# EAGLE design Cpu_pwm_mega1284 (EAGLE 7.6.0)
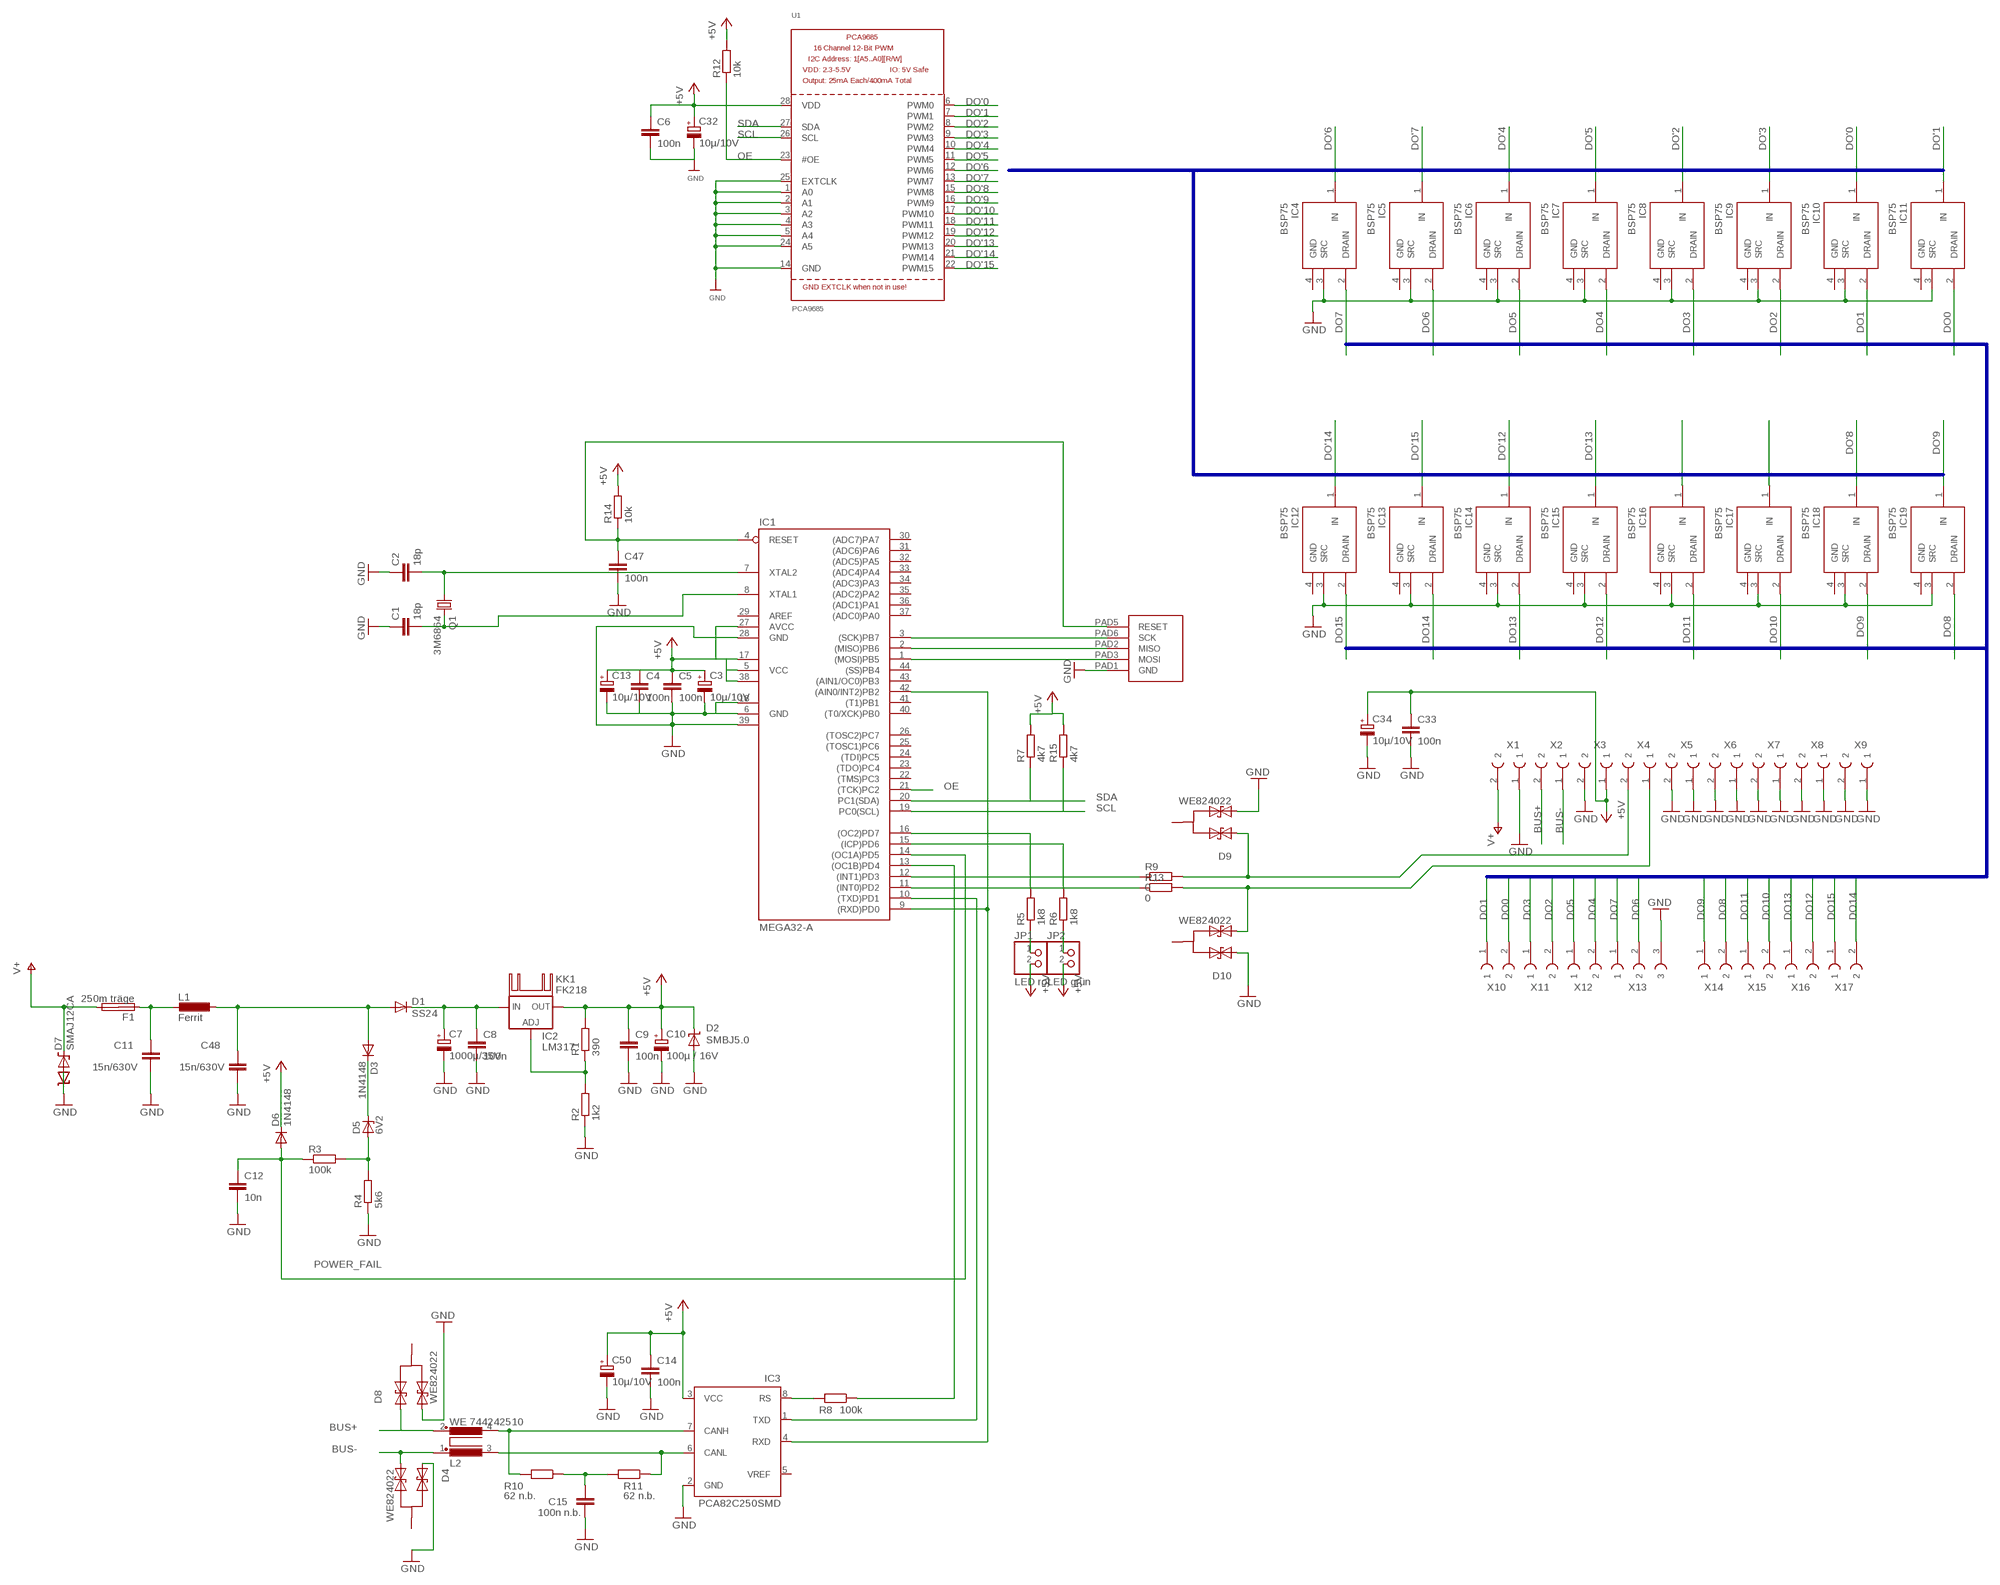
[diagram p0: schematic, sheet 1]

## Parts
C1  18p  C-EUC0603K  [C0603K]
C2  18p  C-EUC0603K  [C0603K]
C3  10µ/10V  CPOL-EUA/3216-18W  [A/3216-18W]
C4  100n  C-EUC0603K  [C0603K]
C5  100n  C-EUC0603K  [C0603K]
C6  100n  C-EUC0603K  [C0603K]
C7  1000µ/35V  CPOL-EUE5-13  [E5-13]
C8  100n  C-EUC0603K  [C0603K]
C9  100n  C-EUC0603K  [C0603K]
C10  100µ / 16V  CPOL-EUSMCD  [SMC_D]
C11  15n/630V  C-EUC1210K  [C1210K]
C12  10n  C-EUC0603K  [C0603K]
C13  10µ/10V  CPOL-EUA/3216-18W  [A/3216-18W]
C14  100n  C-EUC0603K  [C0603K]
C15  100n n.b.  C-EUC0603K  [C0603K]
C32  10µ/10V  CPOL-EUA/3216-18W  [A/3216-18W]
C33  100n  C-EUC0603K  [C0603K]
C34  10µ/10V  CPOL-EUA/3216-18W  [A/3216-18W]
C47  100n  C-EUC0603K  [C0603K]
C48  15n/630V  C-EUC1210K  [C1210K]
C50  10µ/10V  CPOL-EUA/3216-18W  [A/3216-18W]
D1  SS24  DIODE-SMB  [SMB]
D2  SMBJ5.0  SUPPRESSOR-SMBJ  [SMBJ]
D3  1N4148  DIODE-MINIMELF  [MINIMELF]
D4  WE824022  NUP2105L  [SOT23]
D5  6V2  ZENER-DIODESOD80C  [SOD80C]
D6  1N4148  DIODE-MINIMELF  [MINIMELF]
D7  SMAJ12CA  DIODE-DO-214AC  [DO-214AC]
D8  WE824022  NUP2105L  [SOT23]
D9  WE824022  NUP2105L  [SOT23]
D10  WE824022  NUP2105L  [SOT23]
F1  250m träge  SHK20L  [SHK20L]
IC1  MEGA32-A  [TQFP44]
IC2  LM317  LM317TS  [317TS]
IC3  PCA82C250SMD  [SO8]
IC4  BSP75  [SOT223]
IC5  BSP75  [SOT223]
IC6  BSP75  [SOT223]
IC7  BSP75  [SOT223]
IC8  BSP75  [SOT223]
IC9  BSP75  [SOT223]
IC10  BSP75  [SOT223]
IC11  BSP75  [SOT223]
IC12  BSP75  [SOT223]
IC13  BSP75  [SOT223]
IC14  BSP75  [SOT223]
IC15  BSP75  [SOT223]
IC16  BSP75  [SOT223]
IC17  BSP75  [SOT223]
IC18  BSP75  [SOT223]
IC19  BSP75  [SOT223]
JP1  LED rot  PINHD-1X2  [1X02]
JP2  LED grün  PINHD-1X2  [1X02]
KK1  FK218  [FK218]
L1  Ferrit  L-EUL1806  [L1806]
L2  WE 744242510  744242510  [744242510]
Q1  3M6864  CRYSTALHC49UP  [HC49UP]
R1  390  R-EU_R0603  [R0603]
R2  1k2  R-EU_R0603  [R0603]
R3  100k  R-EU_R0603  [R0603]
R4  5k6  R-EU_R0603  [R0603]
R5  1k8  R-EU_R0603  [R0603]
R6  1k8  R-EU_R0603  [R0603]
R7  4k7  R-EU_R0603  [R0603]
R8  100k  R-EU_R0603  [R0603]
R9  0  R-EU_R0603  [R0603]
R10  62 n.b.  R-EU_R1210  [R1210]
R11  62 n.b.  R-EU_R1210  [R1210]
R12  10k  R-EU_R0603  [R0603]
R13  0  R-EU_R0603  [R0603]
R14  10k  R-EU_R0603  [R0603]
R15  4k7  R-EU_R0603  [R0603]
U1  PCA9685  [TSSOP28]
U$1  ATMEL_ISP  [ATMEL_ISP]
X1  AR-KLEMME_508_2POLPTR  [W237-2E]
X2  AR-KLEMME_508_2POLPTR  [W237-2E]
X3  AR-KLEMME_508_2POLPTR  [W237-2E]
X4  AR-KLEMME_508_2POLPTR  [W237-2E]
X5  AR-KLEMME_508_2POLPTR  [W237-2E]
X6  AR-KLEMME_508_2POLPTR  [W237-2E]
X7  AR-KLEMME_508_2POLPTR  [W237-2E]
X8  AR-KLEMME_508_2POLPTR  [W237-2E]
X9  AR-KLEMME_508_2POLPTR  [W237-2E]
X10  AR-KLEMME_508_2POLPTR  [W237-2E]
X11  AR-KLEMME_508_2POLPTR  [W237-2E]
X12  AR-KLEMME_508_2POLPTR  [W237-2E]
X13  AR-KLEMME_508_3POLPTR  [W237-3E]
X14  AR-KLEMME_508_2POLPTR  [W237-2E]
X15  AR-KLEMME_508_2POLPTR  [W237-2E]
X16  AR-KLEMME_508_2POLPTR  [W237-2E]
X17  AR-KLEMME_508_2POLPTR  [W237-2E]

## Nets
+5V: C3.+ C4.1 C5.1 C6.1 C9.1 C10.+ C13.+ C14.1 C32.+ C33.1 C34.+ C50.+ D2.C D6.C IC1.5(VCC) IC1.17(VCC1) IC1.27(AVCC) IC1.38(VCC2) IC2.2(OUT) IC3.3(VCC) JP1.2 JP2.2 R1.2 R7.2 R12.2 R14.2 R15.2 U1.28(VDD) X3.1
/RESET: C47.1 IC1.4(RESET) R14.1 U$1.PAD5(RESET)
BUS+: D8.1 L2.2 X2.2
BUS-: D4.2 L2.1 X2.1
DO0: IC11.2(DRAIN) X10.2
DO1: IC10.2(DRAIN) X10.1
DO2: IC9.2(DRAIN) X11.2
DO3: IC8.2(DRAIN) X11.1
DO4: IC7.2(DRAIN) X12.2
DO5: IC6.2(DRAIN) X12.1
DO6: IC5.2(DRAIN) X13.2
DO7: IC4.2(DRAIN) X13.1
DO8: IC19.2(DRAIN) X14.2
DO9: IC18.2(DRAIN) X14.1
DO10: IC17.2(DRAIN) X15.2
DO11: IC16.2(DRAIN) X15.1
DO12: IC15.2(DRAIN) X16.2
DO13: IC14.2(DRAIN) X16.1
DO14: IC13.2(DRAIN) X17.2
DO15: IC12.2(DRAIN) X17.1
DO'0: IC10.1(IN) U1.6(PWM0)
DO'1: IC11.1(IN) U1.7(PWM1)
DO'2: IC8.1(IN) U1.8(PWM2)
DO'3: IC9.1(IN) U1.9(PWM3)
DO'4: IC6.1(IN) U1.10(PWM4)
DO'5: IC7.1(IN) U1.11(PWM5)
DO'6: IC4.1(IN) U1.12(PWM6)
DO'7: IC5.1(IN) U1.13(PWM7)
DO'8: IC18.1(IN) U1.15(PWM8)
DO'9: IC19.1(IN) U1.16(PWM9)
DO'10: IC16.1(IN) U1.17(PWM10)
DO'11: IC17.1(IN) U1.18(PWM11)
DO'12: IC14.1(IN) U1.19(PWM12)
DO'13: IC15.1(IN) U1.20(PWM13)
DO'14: IC12.1(IN) U1.21(PWM14)
DO'15: IC13.1(IN) U1.22(PWM15)
GND: C1.1 C2.1 C3.- C4.2 C5.2 C6.2 C7.- C8.2 C9.2 C10.- C11.2 C12.2 C13.- C14.2 C15.1 C32.- C33.2 C34.- C47.2 C48.2 C50.- D2.A D4.1 D7.A D8.2 D9.2 D10.1 IC1.6(GND) IC1.18(GND1) IC1.28(GND) IC1.39(GND2) IC3.2(GND) IC4.3(SRC) IC5.3(SRC) IC6.3(SRC) IC7.3(SRC) IC8.3(SRC) IC9.3(SRC) IC10.3(SRC) IC11.3(SRC) IC12.3(SRC) IC13.3(SRC) IC14.3(SRC) IC15.3(SRC) IC16.3(SRC) IC17.3(SRC) IC18.3(SRC) IC19.3(SRC) R2.1 R4.1 U1.1(A0) U1.2(A1) U1.3(A2) U1.4(A3) U1.5(A4) U1.14(GND) U1.24(A5) U1.25(EXTCLK) U$1.PAD1(GND) X1.1 X3.2 X5.1 X5.2 X6.1 X6.2 X7.1 X7.2 X8.1 X8.2 X9.1 X9.2 X13.3
MISO: IC1.2((MISO)PB6) U$1.PAD2(MISO)
MOSI: IC1.1((MOSI)PB5) U$1.PAD3(MOSI)
N$1: C11.1 F1.1A L1.2
N$2: D3.C D5.C
N$3: D5.A R3.2 R4.2
N$4: C1.2 IC1.8(XTAL1) Q1.2
N$6: C2.2 IC1.7(XTAL2) Q1.1
N$7: IC3.8(RS) R8.2
N$8: IC1.13((OC1B)PD4) R8.1
N$9: IC2.1(ADJ) R1.1 R2.2
N$11: IC3.6(CANL) L2.3 R11.1
N$12: IC3.7(CANH) L2.4 R10.2
N$15: C48.1 D1.A D3.A L1.1
N$16: C7.+ C8.1 D1.C IC2.3(IN)
N$18: IC1.11((INT0)PD2) R13.1
N$19: IC1.12((INT1)PD3) R9.1
N$25: C15.2 R10.1 R11.2
N$113: JP1.1 R5.1
N$114: JP2.1 R6.1
N$115: IC1.16((OC2)PD7) R5.2
N$116: IC1.15((ICP)PD6) R6.2
OE: IC1.21((TCK)PC2) R12.1 U1.23(#OE)
POWER_FAIL: C12.1 D6.A IC1.14((OC1A)PD5) R3.1
RXD: IC1.9((RXD)PD0) IC1.42((AIN0/INT2)PB2) IC3.4(RXD)
RXD1: D10.2 R13.2 X4.1
SCK: IC1.3((SCK)PB7) U$1.PAD6(SCK)
SCL: IC1.19(PC0(SCL)) R15.1 U1.26(SCL)
SDA: IC1.20(PC1(SDA)) R7.1 U1.27(SDA)
TSD1: D9.1 R9.2 X4.2
TXD: IC1.10((TXD)PD1) IC3.1(TXD)
V+: D7.C F1.2A X1.2
Unconnected: D4.3 D8.3 D9.3 D10.3 F1.1B F1.2B IC1.22((TMS)PC3) IC1.23((TDO)PC4) IC1.24((TDI)PC5) IC1.25((TOSC1)PC6) IC1.26((TOSC2)PC7) IC1.29(AREF) IC1.30((ADC7)PA7) IC1.31((ADC6)PA6) IC1.32((ADC5)PA5) IC1.33((ADC4)PA4) IC1.34((ADC3)PA3) IC1.35((ADC2)PA2) IC1.36((ADC1)PA1) IC1.37((ADC0)PA0) IC1.40((T0/XCK)PB0) IC1.41((T1)PB1) IC1.43((AIN1/OC0)PB3) IC1.44((SS)PB4) IC3.5(VREF) IC4.4(GND) IC5.4(GND) IC6.4(GND) IC7.4(GND) IC8.4(GND) IC9.4(GND) IC10.4(GND) IC11.4(GND) IC12.4(GND) IC13.4(GND) IC14.4(GND) IC15.4(GND) IC16.4(GND) IC17.4(GND) IC18.4(GND) IC19.4(GND)

## Buses
DO[0..30]
DO'[0..7]
DO'[8..15]

## Library data of the parts
C1 C2 C4-C6 C8 C9 C11 C12 C14 C15 C33 C47 C48 = rcl:C-EU: CAPACITOR, European symbol
C3 C7 C10 C13 C32 C34 C50 = rcl:CPOL-EU: POLARIZED CAPACITOR, European symbol
D1 D3 D6 D7 = diode:DIODE-: DIODE
D2 = diode:SUPPRESSOR-: Suppressor diode
D4 D8-D10 = mylib:NUP2105L
D5 = diode:ZENER-DIODE: Z-Diode
F1 = fuse:SHK20L: FUSE HOLDER 5 x 20 mm, SH contact, SHH1 Schukat, E1073 Buerklin
IC1 = atmel:MEGA32: MICROCONTROLLER 32 Kbytes FLASH 2 Kbytes SRAM 1 Kbytes EEPROM USART 8-channel 10 bit ADC Source: www.atmel.com .. doc2503.pdf; MPN: ATMEGA32-16AU; OC_FARNELL: 9171274; OC_NEWARK: 69K6677
IC2 = v-reg:LM317TS: VOLTAGE REGULATOR
IC3 = mylib:PCA82C250: CAN CONTROLLER INTERFACE
IC4-IC19 = mylib:BSP75
JP1 JP2 = pinhead:PINHD-1X2: PIN HEADER
KK1 = heatsink:FK218: HEATSINK manufacturer Fischer/distributor Buerklin
L1 = mylib:L-EU: INDUCTOR, European symbol
L2 = mylib:744242510
Q1 = crystal:CRYSTAL: CRYSTAL; OC_FARNELL: unknown; OC_NEWARK: unknown
R1-R15 = rcl:R-EU_: RESISTOR, European symbol
U1 = microbuilder:PCA9685: PCA9685 - 16 Channel 12-Bit I2C PWM Controller 5.0V tolerant 16 channel, 12-bit I2C PWM controller with 25mA per output (max. 400mA total) Digikey: 568-5931-1-ND
U$1 = mylib:ATMEL_ISP
X1-X12 X14-X17 = mylib:AR-KLEMME_508_2POL
X13 = mylib:AR-KLEMME_508_3POL

## Board
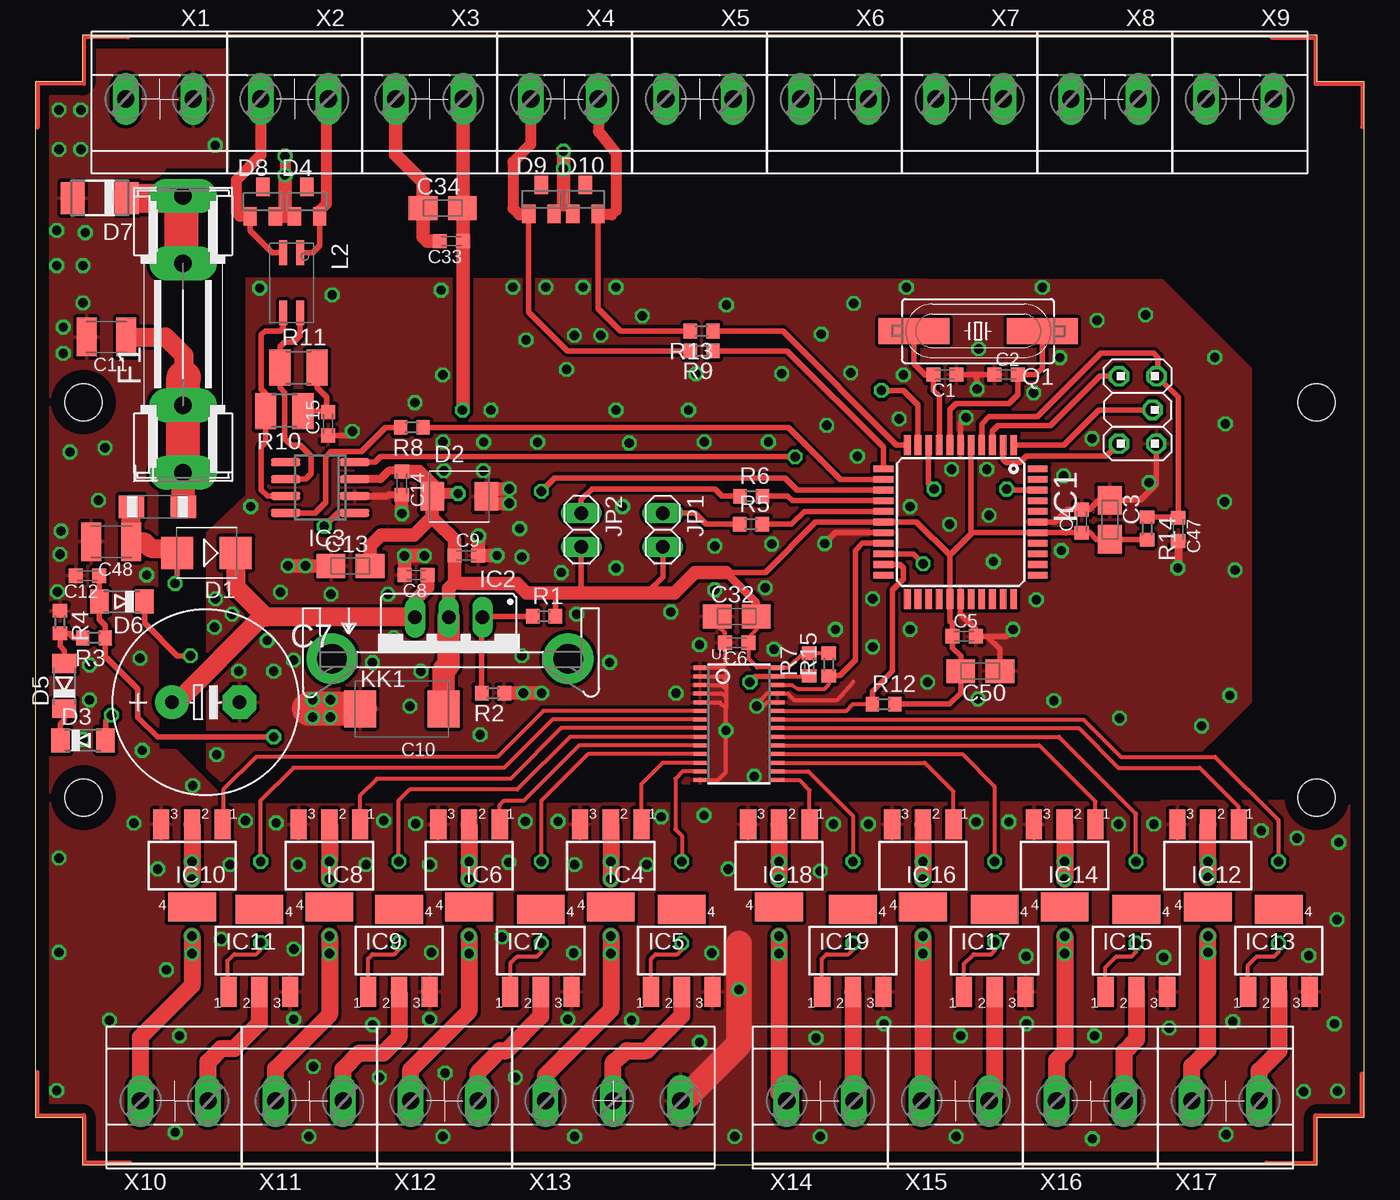
[diagram p1: board, top side]
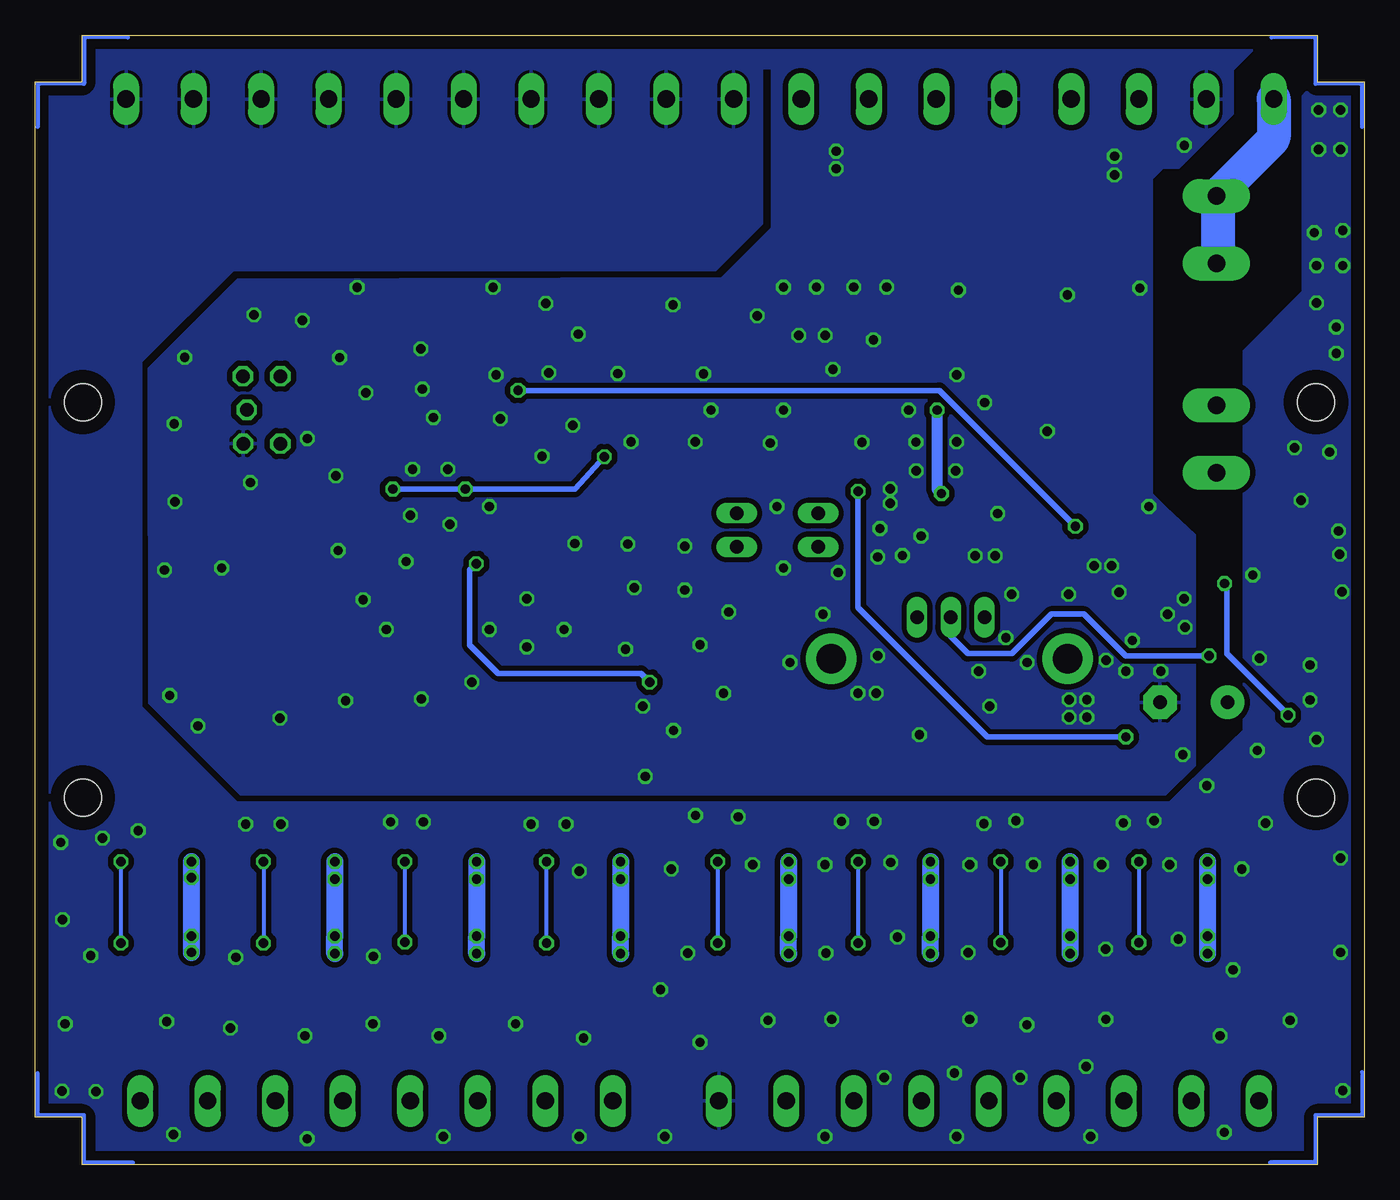
[diagram p2: board, bottom side, seen from below]

Size 100 x 84.99 mm. Coordinates in mm from the lower left corner, seen from the top.
Copper layers (1*16): Top 0.035mm / dielectric 1.5mm / Bottom 0.035mm
Design rules "default": minimum track width 10mil, minimum drill 24mil, track to track 10mil, track to pad 10mil, pad to pad 10mil, via to via 10mil, smd to smd 10mil, copper to edge 40mil, drill to drill 8mil, minimum pad ring 10mil, minimum via ring 8mil, stop-mask expansion 4mil, vias tented up to drill 28mil, thermal gap 10mil

### Footprints (pad centres in the part's own frame; a part is rotated, then mirrored left to right if it is on the bottom)
C0603K = smd 1.05 x 1.08: 1 -0.875,0; 2 0.875,0
A/3216-18W = smd 2.15 x 1.8: + 1.475,0; - -1.475,0
E5-13 = drill 1.016 pad 2.54: + -2.54,0 | drill 1.016 pad 2.54 octagon: - 2.54,0
SMC_D = smd 2.4 x 2.8: + -3.15,0; - 3.15,0
C1210K = smd 1.5 x 2.9: 1 -1.5,0; 2 1.5,0
SMB = smd 2.4 x 2.4: A 2.2,0; C -2.2,0
SMBJ = smd 1.78 x 2.16: A 2.04,0; C -2.03,0
MINIMELF = smd 1.4 x 1.8: A 1.7,0; C -1.7,0
SOT23 = smd 1 x 1.4: 1 -0.95,-1.1; 2 0.95,-1.1; 3 0,1.1
SOD80C = smd 1.4 x 1.8: A 1.7,0; C -1.7,0
DO-214AC = smd 1.8 x 2.4: A 2.025,0; C -2.025,0
SHK20L = drill 1.321 pad 2.54 long: 1A -10.414,0; 1B -5.334,0; 2A 10.414,0; 2B 5.334,0
TQFP44 = smd 1.5 x 0.5: 1 -5.8,4; 2 -5.8,3.2; 3 -5.8,2.4; 4 -5.8,1.6; 5 -5.8,0.8; 6 -5.8,0; 7 -5.8,-0.8; 8 -5.8,-1.6; 9 -5.8,-2.4; 10 -5.8,-3.2; 11 -5.8,-4; 23 5.8,-4; 24 5.8,-3.2; 25 5.8,-2.4; 26 5.8,-1.6; 27 5.8,-0.8; 28 5.8,0; 29 5.8,0.8; 30 5.8,1.6; 31 5.8,2.4; 32 5.8,3.2; 33 5.8,4 | smd 0.5 x 1.5: 12 -4,-5.8; 13 -3.2,-5.8; 14 -2.4,-5.8; 15 -1.6,-5.8; 16 -0.8,-5.8; 17 0,-5.8; 18 0.8,-5.8; 19 1.6,-5.8; 20 2.4,-5.8; 21 3.2,-5.8; 22 4,-5.8; 34 4,5.8; 35 3.2,5.8; 36 2.4,5.8; 37 1.6,5.8; 38 0.8,5.8; 39 0,5.8; 40 -0.8,5.8; 41 -1.6,5.8; 42 -2.4,5.8; 43 -3.2,5.8; 44 -4,5.8
317TS = drill 1.016 long: 1 -2.54,-2.54; 2 0,-2.54; 3 2.54,-2.54
SO8 = smd 0.6 x 2.2: 1 -1.905,-2.6; 2 -0.635,-2.6; 3 0.635,-2.6; 4 1.905,-2.6; 5 1.905,2.6; 6 0.635,2.6; 7 -0.635,2.6; 8 -1.905,2.6
SOT223 = smd 1.219 x 2.235: 1 -2.311,-3.099; 2 0,-3.099; 3 2.311,-3.099 | smd 3.6 x 2.2: 4 0,3.099
1X02 = drill 1.016 long: 1 -1.27,0; 2 1.27,0
FK218 = drill 2.21 pad 3.81: A2,2 -8.89,-0.508; B2,2 8.89,-0.508
L1806 = smd 1.9 x 1.7: 1 -0.68,0; 2 3.22,0
744242510 = smd 1.85 x 0.6: 1 -2.275,0.635; 2 -2.275,-0.635; 3 2.275,0.635; 4 2.275,-0.635
HC49UP = smd 5.334 x 1.93: 1 -4.826,0; 2 4.826,0
R0603 = smd 1 x 1.1: 1 -0.85,0; 2 0.85,0
R1210 = smd 1.6 x 2.7: 1 -1.4,0; 2 1.4,0
TSSOP28 = smd 0.305 x 0.991: 1 -4.225,-2.918; 2 -3.575,-2.918; 3 -2.925,-2.918; 4 -2.275,-2.918; 5 -1.625,-2.918; 6 -0.975,-2.918; 7 -0.325,-2.918; 8 0.325,-2.918; 9 0.975,-2.918; 10 1.625,-2.918; 11 2.275,-2.918; 12 2.925,-2.918; 13 3.575,-2.918; 14 4.225,-2.918; 15 4.225,2.918; 16 3.575,2.918; 17 2.925,2.918; 18 2.275,2.918; 19 1.625,2.918; 20 0.975,2.918; 21 0.325,2.918; 22 -0.325,2.918; 23 -0.975,2.918; 24 -1.625,2.918; 25 -2.275,2.918; 26 -2.925,2.918; 27 -3.575,2.918; 28 -4.225,2.918
ATMEL_ISP = drill 1.016 octagon: PAD1 1.397,-2.54; PAD2 -1.41,-2.54; PAD3 1.13,0; PAD5 1.41,2.54; PAD6 -1.41,2.54
GEHÄUSE_MR6 = hole 2.8: 3.632,57.379; 3.632,27.61; 96.418,27.61; 96.418,57.379
W237-2E = drill 1.3 long: 1 -2.54,0; 2 2.54,0
W237-3E = drill 1.3 long: 1 -5.08,0; 2 0,0; 3 5.08,0

### Placement (x,y rotation side)
C1  68.45,59.45 180 top
C2  73.05,59.45 0 top
C3  80.85,48.53 270 top
C4  78.74,48.43 90 top
C5  69.89,39.76 0 top
C6  52.78,39.28 180 top
C7  12.83,34.8 0 top
C8  28.65,44.37 180 top
C9  32.44,45.83 0 top
C10  27.58,34.3 180 top
C11  5.36,62.28 180 top
C12  3.94,44.32 180 top
C13  23.72,45.06 0 top
C14  27.58,51.28 270 top
C15  22.03,55.74 90 top
C32  52.78,41.26 0 top
C33  31.32,69.49 180 top
C34  30.66,71.97 0 top
C47  85.99,47.8 270 top
C48  5.73,46.88 180 top
C50  71.11,37.13 180 top
D1  12.89,46.04 180 top
D2  31.9,50.29 0 top
D3  3.59,31.93 0 top
D4  20.45,72.47 0 top
D5  2.18,36.02 90 top
D6  6.53,42.37 180 top
D7  4.85,72.73 180 top
D8  17.12,72.47 0 top
D9  38.09,72.63 0 top
D10  41.39,72.63 0 top
F1  11.13,62.48 90 top
IC1  69.62,48.36 270 top
IC2  31.12,38.66 180 top
IC3  21.44,50.95 90 top
IC4  43.31,22.5 180 top
IC5  48.64,16.1 0 top
IC6  32.64,22.5 180 top
IC7  38.04,16.1 0 top
IC8  22.14,22.5 180 top
IC9  27.37,16.1 0 top
IC10  11.8,22.5 180 top
IC11  16.87,16.1 0 top
IC12  88.24,22.5 180 top
IC13  93.57,16.1 0 top
IC14  77.46,22.5 180 top
IC15  82.85,16.1 0 top
IC16  66.79,22.5 180 top
IC17  72.19,16.1 0 top
IC18  55.96,22.5 180 top
IC19  61.52,16.1 0 top
JP1  47.22,47.76 270 top
JP2  41.08,47.76 270 top
KK1  31.22,38.58 0 top
L1  7.92,49.5 0 top
L2  19.29,66.36 270 top
Q1  70.94,62.73 180 top
R1  38.29,41.26 0 top
R2  34.44,35.48 180 top
R3  4.42,39.64 180 top
R4  1.87,40.83 270 top
R5  53.86,48.2 0 top
R6  53.87,50.3 0 top
R7  58.23,37.63 90 top
R8  28.33,55.47 180 top
R9  50.14,61.24 180 top
R10  18.75,56.72 180 top
R11  19.81,59.98 0 top
R12  63.84,34.66 0 top
R13  50.14,62.73 180 top
R14  83.65,47.88 270 top
R15  59.72,37.63 90 top
U1  52.95,33.17 270 top
U$1  82.96,56.79 0 top
U$3  [GEHÄUSE_MR6]  0,0 0 top
X1  9.35,80.19 180 top
X2  19.51,80.19 180 top
X3  29.67,80.19 180 top
X4  39.83,80.19 180 top
X5  49.99,80.19 180 top
X6  60.15,80.19 180 top
X7  70.31,80.19 180 top
X8  80.47,80.19 180 top
X9  90.63,80.19 180 top
X10  10.46,4.8 0 top
X11  20.62,4.8 0 top
X12  30.78,4.8 0 top
X13  43.48,4.8 0 top
X14  59.08,4.8 0 top
X15  69.24,4.8 0 top
X16  79.4,4.8 0 top
X17  89.56,4.8 0 top

### Tracks (layer width: path | path; a pad name or v marks a point on that pad's centre or on a via)
+5V  (via drill 0.7)
  Top 0.254: 42.16,43.03 42.16,43.1 40.73,43.12 40.53,43.12 | C14.1 27.58,52.22
  Top 0.305: C32.+ 54.26,40.26 53.66,39.66 C6.1 53.66,38.08 54.34,37.4 U1.28 56.68,37.4 57.76,38.48 R7.2 R15.2
  Top 0.406: R1.2 39.14,42.98 39.24,43.08 42.49,43.08 42.55,43.03 | 68.82,45.86 66.32,48.36 IC1.17 58.73,48.36 54.93,44.56 51.79,44.56 | 68.82,45.86 IC1.27 68.82,40.91 69.01,40.72 C5.1 69.01,38.9 69.63,38.28 C50.+ 69.63,35.49 68.8,34.66 R12.2 | 70.52,47.56 IC1.38 77.52,47.56 77.55,47.54 77.56,47.55 C4.1 79.35,47.55 79.85,47.05 C3.+ 83.63,47.05 R14.2 | 70.52,47.56 68.82,45.86 | IC1.5 70.42,47.66 70.52,47.56 | JP2.2 41.08,43.48 40.73,43.12 | JP1.2 47.22,44.23 46.01,43.03 | D6.C 8.23,40.74 10.68,38.29 v11.67,38.29
  Top 0.61: IC3.3 25.98,51.59 26.62,52.22 27.58,52.22 | 38.31,43.13 38.25,43.08 39.24,43.08 | 51.96,44.56 54.26,42.26 C32.+
  Top 0.813: v31.81,50.51 30.09,50.51 D2.C
  Top 1.016: C14.1 28.89,52.16 29.85,51.21 29.85,50.32 D2.C 29.87,48.69 | 29.87,48.69 30.23,48.34 30.25,48.34 31.56,47.03 C9.1 31.56,43.82 | 31.56,43.82 31.12,43.37 IC2.2 | 31.56,43.82 32.14,43.74 36.27,43.74 36.98,43.03 42.16,43.03 42.55,43.03 46.01,43.03 48.11,43.03 49.64,44.56 51.79,44.56 51.96,44.56 | C10.+ 30.66,34.38 30.66,34.49 | 29.87,48.69 29.83,48.69 28.51,47.37 26.04,47.37 25.2,46.53 C13.+ | X3.1 32.21,72.05 C34.+ 32.19,71.91 C33.1 32.19,56.83 v32.14,56.78
  Top 1.676: IC2.2 31.12,37.59 30.73,37.21 C10.+
  Bottom 0.406: IC2.2 31.12,41.22 31.15,41.26 31.15,39.78 29.83,38.46 26.53,38.46 23.56,41.43 21.08,41.43 17.95,38.29 v11.67,38.29
  Bottom 0.813: v32.14,56.78 32.14,50.84 v31.81,50.51
/RESET
  Top 0.406: IC1.4 71.22,55.74 71.77,56.29 75.4,56.29 80.19,61.07 84.15,61.07 84.48,60.74 84.48,59.45 U$1.PAD5 84.4,59.33 85.99,57.75 C47.1 85.94,48.73 R14.1
BUS+
  Top 0.406: L2.2 17.82,68.63 16.17,70.28 D8.1
  Top 0.813: D8.1 15.41,71.37 15.14,71.64 15.14,74.12 16.97,75.95 X2.2
BUS-
  Top 0.406: L2.1 20.88,68.63 21.4,69.15 D4.2
  Top 0.813: D4.2 21.4,71.79 21.91,72.3 21.91,80.05 X2.1
DO0
  Top 1.27: IC11.2 16.87,10.63 14.97,8.74 13.98,8.74 13.01,7.76 X10.2
  Bottom 0.61: 13.09,4.89 X10.2
DO1  (via drill 0.7)
  Top 1.27: IC10.2 v11.8,22.81 v11.8,21.49 | v11.8,17.2 11.8,13.49 7.93,9.61 X10.1
  Bottom 0.61: 7.87,4.85 X10.1
  Bottom 1.27: v11.8,22.81 v11.8,17.2 v11.8,15.88
DO2
  Top 1.27: X11.2 23.17,7.19 24.38,8.41 26.2,8.41 27.37,9.58 IC9.2
  Bottom 0.61: 23.33,4.97 X11.2
DO3  (via drill 0.7)
  Top 1.27: IC8.2 v22.14,22.81 v22.14,21.49 | v22.14,17.2 22.14,11.28 18.09,7.23 X11.1
  Bottom 0.61: 18.05,4.84 X11.1
  Bottom 1.27: v22.14,22.81 v22.14,17.2 v22.14,15.88
DO4
  Top 1.27: IC7.2 38.04,11.16 35.45,8.57 34.95,8.57 33.33,6.95 X12.2
  Bottom 0.61: 33.4,4.88 X12.2
DO5  (via drill 0.7)
  Top 1.27: IC6.2 v32.64,22.81 v32.64,21.49 | v32.64,17.2 32.64,11.54 28.25,7.15 X12.1
  Bottom 0.61: 28.28,4.84 X12.1
  Bottom 1.27: v32.64,22.81 v32.64,17.2 v32.64,15.88
DO6
  Top 1.27: IC5.2 48.64,11.2 46.01,8.57 44.53,8.57 43.49,7.7 X13.2
  Bottom 0.61: 43.47,4.81 X13.2
DO7  (via drill 0.7)
  Top 1.27: IC4.2 v43.31,22.81 v43.31,21.49 | v43.31,17.2 43.31,11.65 38.41,6.74 X13.1
  Bottom 0.61: 38.52,4.92 X13.1
  Bottom 1.27: v43.31,22.81 v43.31,17.2 v43.31,15.88
DO8
  Top 1.27: IC19.2 61.52,4.9 X14.2
  Bottom 0.61: 61.47,4.95 X14.2
DO9  (via drill 0.7)
  Top 1.27: IC18.2 v55.96,22.81 v55.96,21.49 | v55.96,17.2 55.96,5.38 X14.1
  Bottom 0.61: 56.35,4.99 X14.1
  Bottom 1.27: v55.96,22.81 v55.96,17.2 v55.96,15.88
DO10
  Top 1.27: IC17.2 72.19,5.21 X15.2
  Bottom 0.61: 71.7,4.88 X15.2
DO11  (via drill 0.7)
  Top 1.27: IC16.2 v66.79,22.81 v66.79,21.49 | v66.79,17.2 66.79,4.89 X15.1
  Bottom 0.61: 66.59,4.92 X15.1
  Bottom 1.27: v66.79,22.81 v66.79,17.2 v66.79,15.88
DO12
  Top 0.61: 81.94,8.51 81.94,5 82,4.94
  Top 1.27: IC15.2 82.86,9.42 81.94,8.51 X16.2
DO13  (via drill 0.7)
  Top 1.27: IC14.2 v77.46,22.81 v77.46,21.49 | v77.46,17.2 77.46,8.48 76.86,7.89 X16.1
  Bottom 0.61: 76.82,4.84 X16.1
  Bottom 1.27: v77.46,22.81 v77.46,17.2 v77.46,15.88
DO14
  Top 1.27: IC13.2 93.57,8.55 92.1,7.07 X17.2
  Bottom 0.61: 92.09,4.81 X17.2
DO15  (via drill 0.7)
  Top 1.27: v88.24,21.59 v88.24,22.81 IC12.2 | X17.1 87.02,7.4 88.24,8.62 v88.24,15.98 v88.24,17.2
  Bottom 0.61: 87.14,4.92 X17.1
  Bottom 1.27: v88.24,22.81 v88.24,17.2 v88.24,15.98
DO'0
  Top 0.305: U1.6 38.24,34.15 34.79,30.7 16.62,30.7 14.15,28.22 14.15,25.64 IC10.1
DO'1  (via drill 0.7)
  Top 0.305: U1.7 38.91,33.5 35.28,29.87 19.43,29.87 16.95,27.39 v16.95,22.81 | IC11.1 14.48,13.08 14.48,15.34 14.97,15.84 16.62,15.84 16.95,16.17 v16.95,16.7
  Bottom 0.305: v16.95,22.81 v16.95,16.7
DO'2
  Top 0.305: U1.8 39.58,32.85 35.78,29.05 25.71,29.05 24.45,27.79 IC8.1
DO'3  (via drill 0.7)
  Top 0.305: U1.9 40.25,32.2 36.27,28.22 28.18,28.22 27.36,27.39 v27.36,22.81 | IC9.1 25.04,13.02 25.04,15.51 25.37,15.84 27.03,15.84 27.36,16.17 v27.36,16.7
  Bottom 0.305: v27.36,22.81 v27.36,16.7
DO'4
  Top 0.305: IC6.1 34.95,27.06 35.28,27.39 36.77,27.39 40.92,31.55 U1.10
DO'5  (via drill 0.7)
  Top 0.305: U1.11 41.59,30.9 38.09,27.39 v38.09,22.81 | IC7.1 35.78,13.06 35.78,15.18 36.27,15.67 37.76,15.67 38.09,16 v38.09,16.66
  Bottom 0.305: v38.09,22.81 v38.09,16.66
DO'6
  Top 0.305: U1.12 47.21,30.25 45.62,28.65 IC4.1
DO'7  (via drill 0.7)
  Top 0.305: U1.13 48.71,29.6 48.16,29.05 48.16,25.25 48.65,24.75 v48.65,22.81 | IC5.1 46.34,13.02 46.34,15.51 46.67,15.84 48.32,15.84 48.65,16.17 v48.65,16.66
  Bottom 0.305: v48.65,22.81 v48.65,16.66
DO'8
  Top 0.305: U1.15 57.5,28.95 58.27,28.18 IC18.1
DO'9  (via drill 0.7)
  Top 0.305: U1.16 58.17,29.6 61.53,26.24 v61.53,22.81 | IC19.1 59.21,15.49 59.55,15.84 61.2,15.84 61.53,16.17 v61.53,16.66
  Bottom 0.305: v61.53,16.66 v61.53,22.81
DO'10
  Top 0.305: U1.17 66.93,30.25 69.1,28.08 IC16.1
DO'11  (via drill 0.7)
  Top 0.305: U1.18 69.75,30.9 72.19,28.46 v72.19,22.81 | IC17.1 69.88,15.1 70.61,15.84 71.93,15.84 72.19,16.09 v72.19,16.75
  Bottom 0.305: v72.19,16.75 v72.19,22.81
DO'12
  Top 0.305: U1.19 75.54,31.55 79.77,27.32 IC14.1
DO'13  (via drill 0.7)
  Top 0.305: U1.20 77.04,32.2 82.83,26.4 v82.83,22.81 | IC15.1 80.52,13.03 80.52,14.85 81.34,15.67 82.5,15.67 82.83,16 v82.83,16.66
  Bottom 0.305: v82.83,22.81 v82.83,16.66
DO'14
  Top 0.305: U1.21 78.53,32.85 81.51,29.87 87.62,29.87 90.55,26.94 IC12.1
DO'15  (via drill 0.7)
  Top 0.305: U1.22 78.87,33.5 81.67,30.7 88.77,30.7 93.56,25.91 v93.56,22.81 | IC13.1 91.25,15.01 91.91,15.67 93.23,15.67 93.56,16 v93.56,16.66
  Bottom 0.305: v93.56,22.81 v93.56,16.66
GND  (via drill 0.7)
  Top 0.305: U1.14 51.36,28.95 51.96,29.54 51.96,32.35 | 51.96,32.35 51.96,34.33 | U1.5 51.49,34.8 51.96,34.33 | U1.4 51.66,35.45 51.96,35.15 | U1.3 51.67,36.1 51.96,35.81 | 51.96,35.81 51.96,35.15 | U1.2 51.68,36.75 51.96,36.47 | 51.96,36.47 51.96,35.81 | U1.1 51.69,37.4 | 51.69,37.4 51.96,37.14 51.96,36.47 | 51.96,35.15 51.96,34.33 | U1.24 55.07,34.8 54.6,34.33 54.6,34.49 | 54.6,34.49 54.6,34.99 55.06,35.45 U1.25 56.62,35.45 57.07,34.99 60.38,34.99 61.56,36.33 | v51.97,32.68 51.97,32.36 51.96,32.35 | v54.28,34.49 54.6,34.49 | 51.69,37.4 51.91,37.61 C6.2 51.91,39.99 51.31,40.59 C32.-
  Top 0.406: C15.1 23.52,54.87 v23.85,55.19 | 20.78,34.3 20.78,33.77 v20.88,33.67 | IC1.6 69.62,55.8 v70.04,56.22 | v70.87,58.37 70.87,59.17 70.59,59.45 C1.1 C2.1 | IC1.39 76.72,48.36 77.66,49.3 C4.2 79.31,49.3 80.01,50 C3.- 83.15,50 84.35,51.21 U$1.PAD1 | IC1.18 60.22,47.56 v59.4,46.74 | IC1.28 69.62,41.43 70.76,40.29 C5.2 71.62,39.76 | 71.62,39.76 72.58,38.8 C50.- | 71.62,39.76 73.08,39.76 v73.58,40.27 | D10.1 39.74,72.23 D9.2
  Top 0.508: IC3.2 26.51,50.32 26.6,50.41 C14.2
  Top 0.61: C47.2 85.99,44.92 v85.97,44.89
  Top 0.813: v18.8,75.9 v18.8,74.47
  Top 1.016: C8.2 | C8.2 27.76,44.37 | C9.2 33.38,45.83 | 33.38,45.83 v34.75,45.83 | 33.38,45.83 33.35,45.86 v33.35,47.31 | 27.58,50.42 C14.2 v27.58,49 | v35.66,50.85 33.93,50.85 D2.A 33.96,50.29 33.96,49.76 v35.66,49.76 | R2.1 v36.73,35.48 v38.1,35.48 | C8.2 27.78,45.82 v29.29,45.82 | D8.2 18.41,71.37 | D4.1 18.61,71.37 | 18.61,71.37 18.41,71.37 | 18.41,71.37 arc45 18.28,71.31 | v18.8,74.47 18.8,71.66 arc-45 18.72,71.48 18.61,71.37 | C13.- v19.01,45.06 18.94,45.06 | 39.74,72.23 v39.74,76.26 | X3.2 27.13,76 29.18,73.94 C34.- 29.18,69.81 29.5,69.49 C33.2
  Top 1.93: 52.95,16.66 52.95,9.07 48.57,4.69 | 48.57,4.69 48.49,4.61 | X13.3 48.57,4.7 48.57,4.69
  Top 2.54: C10.- 20.78,34.3 20.59,34.33
  other vias: 43.22,37.8 61.58,64.81 70.94,35.04 89.5,49.89 22.34,65.44 28.61,25.67 87.77,33.02 19.46,16.23 81.58,33.6 74.55,15.67 95.82,15.74 98.08,24.24 97.75,10.6 89.54,55.76 30.54,65.81 83.54,63.96 1.85,45.92 1.66,43.1 27.76,45.82 95.44,5.5 28.56,57.34 52.01,64.69 88.76,60.74 79.9,63.54 90.27,44.74 89.89,35.31 29.79,15.96 7.42,25.69 84.91,15.61 97.94,18.44 97.98,5.54 2.6,53.62 5.25,53.95 4.09,37.6 3.59,31.99 22.2,34.99 22.2,33.67 20.88,34.99 1.78,79.38 3.43,79.38 1.78,76.4 1.61,70.29 1.61,67.65 2.11,61.05 2.11,63.03 3.59,64.85 4.75,49.99 1.94,47.68 7.89,38.1 8.05,31.17 18.12,25.72 1.78,15.98 1.61,5.58 26.21,25.88 15.81,25.88 3.43,76.4 3.76,70.13 3.59,67.65 1.78,23.08 11.85,28.52 20.33,45.06 56.17,59.52 16.88,65.96 52.96,13.17 50.32,26.29 94.95,24.57 72.1,45.39 71.77,48.86 68.8,48.2 65,56.12 59.55,55.63 44.69,54.31 36.93,62.06 34.29,56.78 65.33,59.42 83.82,51.33 67.14,36.31 65.82,40.27 63.02,42.58 63.02,38.95 54.1,29.21 55.59,38.79 60.21,40.27 49.97,39.12 40.73,41.43 43.7,44.89 51.13,46.55 33.46,32.35 35.94,66.03 36.87,25.83 40.5,15.93 39.34,25.83 47.1,26.16 50.9,15.93 60.06,25.63 70.79,25.79 62.7,25.63 73.27,25.79 81.52,25.63 84.16,25.63 92.25,25.13 90.11,10.77 85.32,10.27 74.59,10.6 63.86,10.6 40.08,10.93 29.68,10.93 19.44,10.93 9.87,14.66 5.58,10.86 76.64,34.92 75.32,42.52 77.38,51.83 79.53,54.64 59.14,62.49 48.21,35.47 33.73,54.37 16.21,49.52 13.56,42.58 8.38,44.37 30.74,52.21 36.44,47.87 36.6,45.72 39.57,44.56 44.2,49.52 61.86,53.31 55.17,54.39 49.15,56.78 36.6,38.29 29.01,37.13 28.18,34.49 25.37,37.8 13.49,40.44 18.44,43.08 26.53,42.91 22.24,42.91 15.3,37.13 14.81,41.43 17.45,39.45 19.43,37.96 17.95,37.13 26.97,39.65 51.13,43.24 47.83,41.59 54.93,43.41 55.42,46.71 43.7,56.78 65.82,49.52 70.99,61.39 75.78,66.01 65.54,66.01 75.12,58.09 77.1,60.73 77.22,46.22 13.54,76.71 13.65,30.86 50.34,54.39 49.72,59.51 39.98,59.84 37.8,54.36 30.68,54.39 10.86,9.7 25.39,10.53 20.93,7.39 25.88,6.57 30.84,6.9 35.13,17.13 35.62,22.75 29.68,22.58 24.89,22.58 19.77,22.58 14.66,22.58 14,16.97 9.21,22.25 40.58,22.58 36.12,6.57 44.87,10.86 46.02,22.58 52.13,22.25 49.99,9.21 59.07,22.09 58.74,9.54 69.63,9.7 79.71,9.7 52.63,2.11 40.58,2.11 30.67,2.11 20.6,2.11 10.53,2.44 59.07,2.11 69.3,2.11 79.54,1.94 89.61,2.27 4.09,34.96 68.96,52.32 71.6,52.32 39.74,74.94 43.7,66.03 45.68,63.88 33.71,52.21 61.37,59.59 38.42,66.03 42.54,62.4 41.22,66.03 40.56,62.4 30.66,59.42
  pour Bottom (isolate 0.406): 84.51,27.86 14.97,27.89 12.79,30.04 12.79,47.4 14.97,49.43 16.01,50.47 16.01,74.18 15.14,75.06 13.94,75.06 9.93,79.07 9.93,82.4 8.38,83.95 8.38,84.86 96.34,84.86 96.34,81.36 99.87,81.36 99.87,3.68 96.34,3.68 96.34,0.13 3.63,0.15 3.63,3.68 0.13,3.68 0.13,81.38 3.75,81.38 4.57,80.39 4.57,65.7 9.03,61.24 9.03,32.68 13.32,28.55 14.64,27.23 84.84,27.23 92.05,34.44 92.05,60.41 85.12,67.35 48.82,67.35 45.35,70.82 45.35,82.54 44.53,82.54 44.53,70.48 48.32,66.69 84.79,66.56 91.41,59.92 91.39,34.75
  pour Top: 100.1,27.33 92.21,27.37 84.79,27.32 84.99,27.03 84.82,27.25 14.67,27.08 14.66,27.08 10.52,31.19 0.11,30.86 -0.05,3.78 0.11,3.62 3.58,3.62 3.61,0.1 96.28,0.15 96.28,3.59 99.87,3.76
  pour Top: 3.75,84.85 14.48,84.85 14.48,75.11 9.86,75.11 9.03,74.12 9.19,29.71 0.28,29.71 0.11,81.38 3.75,81.38
  pour Top: 15.96,66.69 84.15,66.52 84.81,66.52 91.41,59.92 91.41,34.82 85.31,28.71 14.15,28.71 12.99,29.87 12.99,47.54 15.96,50.34
MISO
  Top 0.406: IC1.2 72.82,53.09 73.09,52.82 74.08,52.82 74.57,53.31 80.61,53.31 U$1.PAD2
MOSI
  Top 0.406: IC1.1 77.4,54.16 80.04,56.79 U$1.PAD3
N$1
  Top 1.422: C11.1 9.8,62.28 11.18,60.91 11.18,57.97 11.15,52.16
  Top 1.778: L1.2 11.15,52.05 F1.1A 11.15,52.09 11.15,52.16
  Top 2.54: 11.15,52.16 11.15,59.23 11.18,59.26
N$2
  Top 0.406: D5.C 2.18,33.43 1.89,33.14 D3.C
N$3
  Top 0.406: 1.92,39.69 R4.2 | D5.A 2.18,38.7 1.87,39.01 R4.2 | R3.2 2.9,39.64 2.55,39.98 R4.2
N$4
  Top 0.406: IC1.8 68.02,57.82 67.58,58.27 C1.2 67.72,59.42 66.98,59.42 66.12,60.29 Q1.2
N$5
  Bottom 2.54: 11.01,72.8 11.01,68.01
N$6
  Top 0.406: IC1.7 68.82,56.81 69.29,57.28 73.25,57.28 73.93,57.95 C2.2 75.26,59.45 75.77,59.96 Q1.1
N$7
  Top 0.406: IC3.8 21.06,49.05 21.83,49.82 21.83,53.24 22.24,53.64 24.55,53.64 26.38,55.47 R8.2
N$8
  Top 0.406: R8.1 56.69,55.47 60.6,51.56 IC1.13
N$9
  Top 0.254: 33.46,35.48 R2.2 33.39,35.48
  Top 0.406: R1.1 33.72,41.26 IC2.1 33.63,41.17 33.63,41.1 33.59,40.9 R2.2
N$11
  Top 0.406: L2.3 19.93,62.4 19.43,61.9 18.77,61.9 18.41,61.54 R11.1 18.41,58.46 18.77,58.1 18.77,54.64 19.27,54.14 19.93,54.14 20.75,53.31 20.75,51.99 20.35,51.59 IC3.6
N$12
  Top 0.406: L2.4 18.66,62.94 18.44,62.73 17.28,62.73 17.02,62.46 17.02,58.37 17.35,58.04 R10.2 17.35,54.37 17.02,54.04 17.02,50.78 17.48,50.32 IC3.7
N$15  (via drill 0.7)
  Top 0.254: 10.35,46.88 10.41,46.88 arc-45 10.59,46.8 10.85,46.55
  Top 0.406: D3.A 5.29,33.4 v5.73,33.83 | v10.52,43.74 10.68,43.9 10.68,46.55 | 10.68,46.55 10.68,46.71 | 10.35,46.88 10.68,46.88 | 10.68,47.04 | 10.68,47.04 D1.A 10.69,46.89 10.35,46.55 10.68,46.55 | 10.68,47.04 10.85,46.88 10.85,47.04 10.68,47.04 | 10.68,46.88 10.68,47.04 | 10.68,46.88 10.68,46.71 | 10.68,46.71 10.85,46.55 10.68,46.55
  Top 1.422: L1.1 arc45 7.23,49.63 C48.1 8.1,46.88 arc-45 8.28,46.8 8.7,46.38 10.41,46.38 arc45 10.59,46.45 10.68,46.55
  Bottom 0.406: v5.73,33.83 10.35,38.46 10.35,43.24 v10.52,43.74
N$16
  Top 1.016: IC2.3 28.58,42.48 29.53,43.43 C8.1
  Top 1.422: IC2.3 17.35,41.2 17.2,41.35 | 17.2,41.35 15.09,43.46 D1.C | C7.+ 10.66,34.8 17.2,41.35
N$17
  Top 2.54: 11.18,68.01 arc-90 11.01,68.17 11.01,72.47
N$18
  Top 0.406: IC1.11 64.81,54.16 56.25,62.73 R13.1
N$19
  Top 0.406: IC1.12 63.82,54 56.58,61.24 R9.1
N$25
  Top 0.406: R10.1 21.97,56.72 22.07,56.62 C15.2 21.91,56.74 21.91,57.77 21.21,58.47 R11.2
N$113
  Top 0.406: JP1.1 49.63,49.03 50.47,48.2 R5.1
N$114
  Top 0.406: R6.1 51.66,50.3 51.13,50.84 41.88,50.84 41.08,50.04 JP2.1
N$115
  Top 0.406: IC1.16 57.87,49.16 56.91,48.2 R5.2
N$116
  Top 0.406: IC1.15 56.96,49.96 56.62,50.3 R6.2
OE
  Top 0.305: U1.23 61.02,34.15 61.51,34.63 62.97,34.63 R12.1
  Top 0.406: IC1.21 65.06,45.16 65.33,44.89 65.33,44.07 64.5,43.24 64.5,37.14 62.99,35.62 R12.1
POWER_FAIL  (via drill 0.7)
  Top 0.406: C12.1 4.81,44.31 4.74,44.23 4.83,44.14 D6.A 4.83,41.01 5.27,40.56 R3.1 5.27,38.25 7.71,35.81 7.71,33.67 9.2,32.18 v17.95,32.18 | IC1.14 57.32,50.76 56.41,51.66 39.08,51.66 v38.09,50.67
  Bottom 0.406: v38.09,50.67 38.09,41.92 28.35,32.18 v17.95,32.18
RXD  (via drill 0.7)
  Top 0.406: IC3.4 25.58,52.86 25.97,53.27 v57.18,53.27 | IC1.42 73.17,50.76 v73.09,50.84 | IC1.9 67.22,51.26 v67.64,50.84
  Bottom 0.406: v73.09,50.84 v67.64,50.84 59.39,50.84 v57.18,53.27
RXD1
  Top 0.406: D10.2 42.34,64.42 44.03,62.73 R13.2
  Top 0.813: X4.1 42.37,77.76 43.7,76.1 43.7,71.81 43.37,71.48 42.4,71.48 D10.2
SCK
  Top 0.406: IC1.3 72.02,55.22 72.43,55.63 76.39,55.63 80.1,59.33 U$1.PAD6
SCL
  Top 0.305: U1.26 56.96,36.1 57.4,35.81 59.39,35.81 59.72,36.14 R15.1
  Top 0.406: IC1.19 62.24,46.76 61.7,46.22 61.7,37.96 60.54,36.8 59.74,36.8 R15.1
SDA  (via drill 0.7)
  Top 0.305: U1.27 58.2,36.75 R7.1
  Top 0.406: IC1.20 66.08,45.96 v66.81,45.22 | 54.1,36.64 v53.77,36.31 54.21,36.75 U1.27
  Bottom 0.406: v66.81,45.22 67.31,44.73 67.31,39.12 65.16,36.97 54.43,36.97 v53.77,36.31
TSD1
  Top 0.406: R9.2 40.07,61.24 37.14,64.17 D9.1
  Top 0.813: X4.2 37.29,76.78 35.94,75.44 35.94,71.97 36.44,71.48 37.08,71.48 D9.1
TXD  (via drill 0.7)
  Top 0.406: 24,49.05 IC3.1 22.76,49.05 v21.74,48.03 | IC1.10 66.42,57.18 65.33,58.27 v63.68,58.27
  Bottom 0.406: v63.68,58.27 31.98,58.27 v21.74,48.03
V+
  Top 2.184: D7.C 10.86,72.73
  Top 2.54: 10.86,72.73 arc45 11.03,72.81 F1.2A
  Bottom 0.406: 6.88,77.14 6.88,80.11 X1.2
  Bottom 2.54: X1.2 6.81,77.32 | 6.88,77.14 F1.2A